# Altium schematic sheet qbI0000115v1.1.1.SchDoc
size A4; PageSetup: Record=PageOptions|CenterHorizontal=True|CenterVertical=True|PrintScale=1.00|XCorrection=1.00|YCorrection=1.00|PrintKind=0|BorderSize=5000000|LeftOffset=0|BottomOffset=0|Orientation=2|PaperLength=1000|PaperWidth=1000|Scale=100|PaperSource=7|PrintQuality=-3|MediaType=1|DitherType=10|PrintScaleMode=1|PaperKind=A4|PaperIndex=9; Author: MP; Organization: Centro "E. Piaggio"; Address1: University of Pisa; Address2: Largo L. Lazzarino, 1; Address3: 56122 Pisa; Address4: Italy
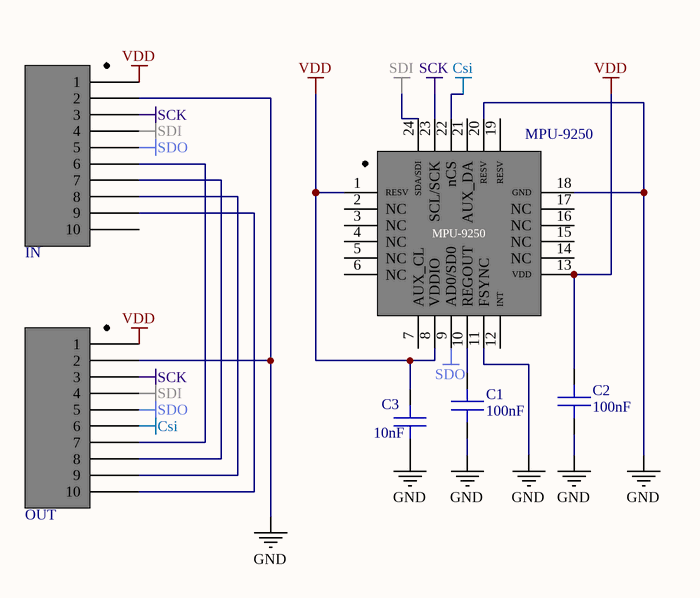
[diagram p0: qbI0000115v1.1.1.SchDoc]

## Parts
C1  100nF  [C0603C104K5RACAUTO]
C2  100nF  [C0603C104K5RACAUTO]
C3  10nF  [C0603C103J8RACTU]
IN  JST SM10B-XSRS-ETB  [SM10B-XSRS-ETB]  (value not drawn)
MPU-9250  MPU-9250  [MPU-2950]
OUT  JST SM10B-XSRS-ETB  [SM10B-XSRS-ETB]  (value not drawn)

## Nets
Csi: MPU-9250.22(nCS) OUT.6
GND: C1.1 C2.1 C3.1 IN.2 MPU-9250.11(FSYNC) MPU-9250.18(GND) MPU-9250.20(RESV) OUT.2
SCK: IN.3 MPU-9250.23(SCL/SCK) OUT.3
SDI: IN.4 MPU-9250.24(SDA/SDI) OUT.4
SDO: IN.5 MPU-9250.9(AD0/SD0) OUT.5
VDD: C2.2 C3.2 IN.1 MPU-9250.1(RESV) MPU-9250.8(VDDIO) MPU-9250.13(VDD) OUT.1
NetC1_2: C1.2 MPU-9250.10(REGOUT)
NetIN_6: IN.6 OUT.7
NetIN_7: IN.7 OUT.8
NetIN_8: IN.8 OUT.9
NetIN_9: IN.9 OUT.10

Not connected (* = marked no-connect by the designer): IN 10; MPU-9250 2(NC) 3(NC) 4(NC) 5(NC) 6(NC) 7(AUX_CL) 12(INT) 14(NC) 15(NC) 16(NC) 17(NC) 19(RESV) 21(AUX_DA)

## Notes on the sheet
- Title
- Date:
- File:
- Time:
- Author:

## Library data of the parts
C1 C2 = C0603C104K5RACAUTO: KEMET 100nF 0603 Cer 50VDC 10% X7R MLCC; Supplier 1: Digi-Key; Supplier Part Number 1: 399-6856-2-ND
C3 = C0603C103J8RACTU: Kemet C 10nF 0603 Cer 10VDC 5% X7R MLCC; Capacitanza: 0.01 uF; Lunghezza: 1.6 mm; Package/involucro: 0603 (1608 metric); Confezione: Reel; Prodotto: General Type MLCCs; Serie: C0603C; Stile di terminazione: SMD/SMT; Tipo: SMD MLCC X7R 6.3 - 250 VDC Commerical Grade; Larghezza: 0.8 mm; Codice involucro - poll.: 0603; Codice involucro - mm: 1608; Classe: Class 2; Temperatura di lavoro massima: + 125 C; Temperatura di lavoro minima: - 55 C; Categoria prodotto: 0603 SMD Ceramic Chip Capacitors; Quantità collo standard: 4000; Supplier 1: Mouser; Manufacturer: Kemet; Manufacturer Part Number: C0603C103J8RACTU; RoHS: RoHS Compliant; Category: Condensatori in ceramica multistrato MLCC - SMD/SMT; Stock 1: 10774; Altezza: -; Tolleranza: 5 %; Tensione nominale CA: -; Tensione nominale CC: 10 VDC; Marchio: Kemet; In dielettrico: X7R; Produttore: Kemet; RoHS - Mouser: Y; Minimum Order Quantity: 1; Reeling: True; ComponentLink1URL: http://www.mouser.com/ds/2/212/KEM_C1002_X7R_SMD-357932.pdf; ComponentLink1Description: http://www.mouser.com/ds/2/212/KEM_C1002_X7R_SMD-357932.pdf; Supplier Part Number 1: 80-C0603C103J8R
IN OUT = SM10B-XSRS-ETB: JST 10WAY angle XSR, SMT, 0.6mm, SM10B-XSRS-ETB; number_of_contacts: 10; contact_material: Copper; mounting_style: Through Hole; gender: Male; contact_plating: Tin; Product Range: XSR Series; Pitch Spacing: 0.6; No. of Rows: 1; Courant: 0.2A; Matériau du contact: Alliage de cuivre; Méthode de raccordement: Montage en surface; Numéro de série: SM10B; Orientation du corps: Droit; Tension: 30 V c.a./c.c.; Currency: EUR; Catalogue Price: 1,192; Product StockNumber: 820-1677; Product Status: IN_STOCK; Manufacturer: JST; Manufacturer Part Number: SM10B-XSRS-ETB; rohs_status: Compliant; Octopart Url: http://octopart.com/sm10b-xsrs-etb-jst-29522047; Seller Landing  Url: https://octopart-clicks.com/click/track?country=IT&ak=8157f166&sig=06796d5&sid=2402&ppid=29522047&vpid=200245201&ct=offers; OctopartID: 60b7a87f3daebf70; ComponentLink1URL: http://datasheet.octopart.com/SM10B-XSRS-ETB-JST-datasheet-12514066.pdf; ComponentLink1Description: http://datasheet.octopart.com/SM10B-XSRS-ETB-JST-datasheet-12514066.pdf; Supplier 1: Newark; RoHS: YES; Stock 1: 0; Contact Termination Type: Through Hole; No. of Contacts: 10; Contact Plating: Tin; Contact Material: Copper; ComponentLink2URL: http://www.farnell.com/datasheets/1706598.pdf; ComponentLink2Description: http://www.farnell.com/datasheets/1706598.pdf; Supplier 2: RS-Components; Category: Connecteurs; Stock 2: 0; Nombre de contacts: 10; Nombre de rangées: 1; Pas: 0.6mm; Séries: XSR; Type: Fil à carte; Minimum Order Quantity: 5; Supplier Part Number 1: 90W0858; Supplier Part Number 2: 820-1677
MPU-9250 = MPU-9250: MPU-9250 3X3X1 24QFN; Manufacturer: InvenSense; Tipo sensore: Accelerometro, giroscopio, magnetometro, 3 assi; Tipo di uscita: I²C, SPI; Supplier 1: Digi-Key; Manufacturer Part Number: MPU-9250; RoHS: RoHS Compliant; Category: Sensori, Trasduttori; Stock 1: 25406; ComponentLink1URL: http://store.invensense.com/datasheets/invensense/MPU9250REV1.0.pdf; ComponentLink1Description: http://store.invensense.com/datasheets/invensense/MPU9250REV1.0.pdf; Supplier Part Number 1: 1428-1019-1-ND